# Altium schematic sheet 8_h-bridge.SchDoc: H-Bridge DC Motor
size A4; DocumentNumber: 9; SheetNumber: 9; SheetTotal: 11
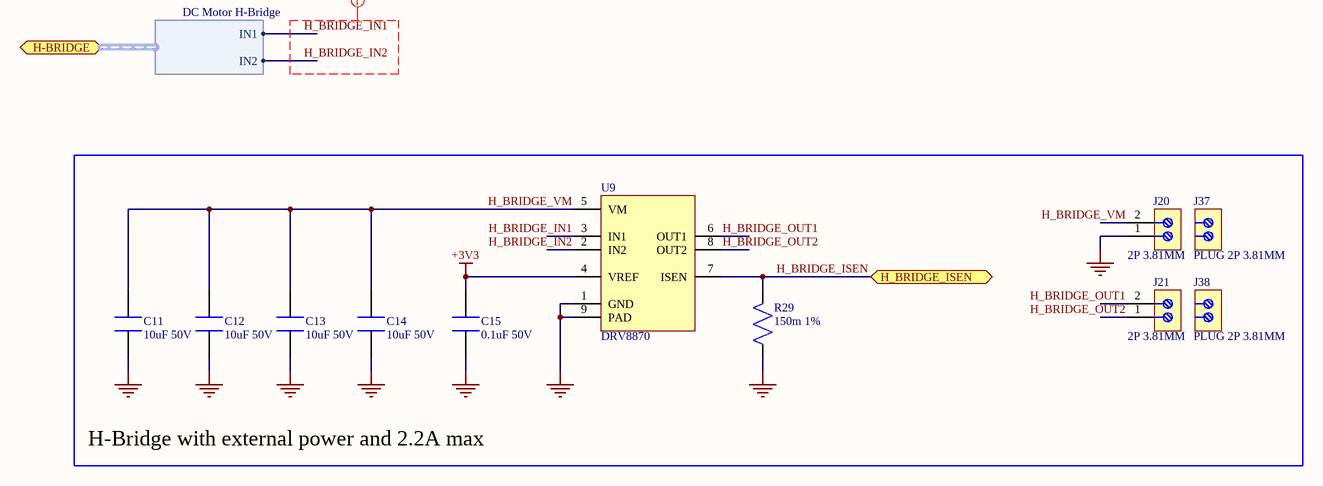
[diagram p0: 8_h-bridge.SchDoc]

## Parts
C11  10uF 50V  [C0805]
C12  10uF 50V  [C0805]
C13  10uF 50V  [C0805]
C14  10uF 50V  [C0805]
C15  0.1uF 50V  [C0603]
J20  2P 3.81MM  [TB-2P-3.81MM]  (no BOM)
J21  2P 3.81MM  [TB-2P-3.81MM]  (no BOM)
J37  PLUG 2P 3.81MM  [TB-PLUG-2P-3.81MM]  (no BOM)
J38  PLUG 2P 3.81MM  [TB-PLUG-2P-3.81MM]  (no BOM)
R29  150m 1%  [R2512]
U9  DRV8870  [HSOP-8]

## Blocks framed on the sheet
H-Bridge with external power and 2.2A max: C11-C15 J20 J21 J37 J38 R29 U9

## Ports
H-BRIDGE (bidir, harness DC Motor H-Bridge), H_BRIDGE_ISEN (bidir)

## Harnesses
DC Motor H-Bridge: IN1, IN2

## Nets
+3V3: C15.1 U9.4(VREF)
GND: C11.2 C12.2 C13.2 C14.2 C15.2 J20.1 R29.1 U9.1(GND) U9.9(PAD)
H_BRIDGE_IN1: U9.3(IN1) ; port H-BRIDGE.IN1
H_BRIDGE_IN2: U9.2(IN2) ; port H-BRIDGE.IN2
H_BRIDGE_ISEN: R29.2 U9.7(ISEN) ; port H_BRIDGE_ISEN
H_BRIDGE_OUT1: J21.2 U9.6(OUT1)
H_BRIDGE_OUT2: J21.1 U9.8(OUT2)
H_BRIDGE_VM: C11.1 C12.1 C13.1 C14.1 J20.2 U9.5(VM)

## Layout directives
net class H_BRIDGE_PWM: H_BRIDGE_IN1, H_BRIDGE_IN2

## Notes on the sheet
- Title
- Size:
- Date:
- A4
- Number:
- Time:
- Revision:
- Sheet
- of
- SmartyBoy
- alkonosst
- github.com/alkonosst <http://github.com/alkonosst>
- Designer:

## Library data of the parts
C11-C14 = GRM21BR61H106KE43L: X5R ±10% 50V 10uF 0805 Multilayer Ceramic Capacitors MLCC - SMD/SMT; LCSC part: C440198; Category: Capacitors: Multilayer Ceramic Capacitors MLCC - SMD/SMT
C15 = CC0603KRX7R9BB104: X7R 100nF ±10% 50V 0603 Multilayer Ceramic Capacitors MLCC - SMD/SMT; LCSC part: C14663; Category: Capacitors: Multilayer Ceramic Capacitors MLCC - SMD/SMT
J20 J21 = TBLOCK-2P-3.81MM: Terminal Block 2 Positions 3.81MM; Category: Connectors: Pluggable System Terminal Block
J37 J38 = PLUG-2P-3.81MM: Terminal block plug 2positions 3.81mm; Category: Connectors: Pluggable System Terminal Block
R29 = MA251220FR150FZ: ±1% 0.15Ω ±50ppm/℃ 2W 2512 Current Sense Resistors/Shunt Resistors; LCSC part: C252673; Category: Resistors: Current Sense Resistors/Shunt Resistors
U9 = DRV8870DDAR: HSOP-8 Motor Driver ICs; LCSC part: C86590; Category: Power Management ICs: Motor Driver ICs